# EAGLE design MobilityEliminationController (EAGLE 6.6.0)

## Sheet 1 of 3: MCU
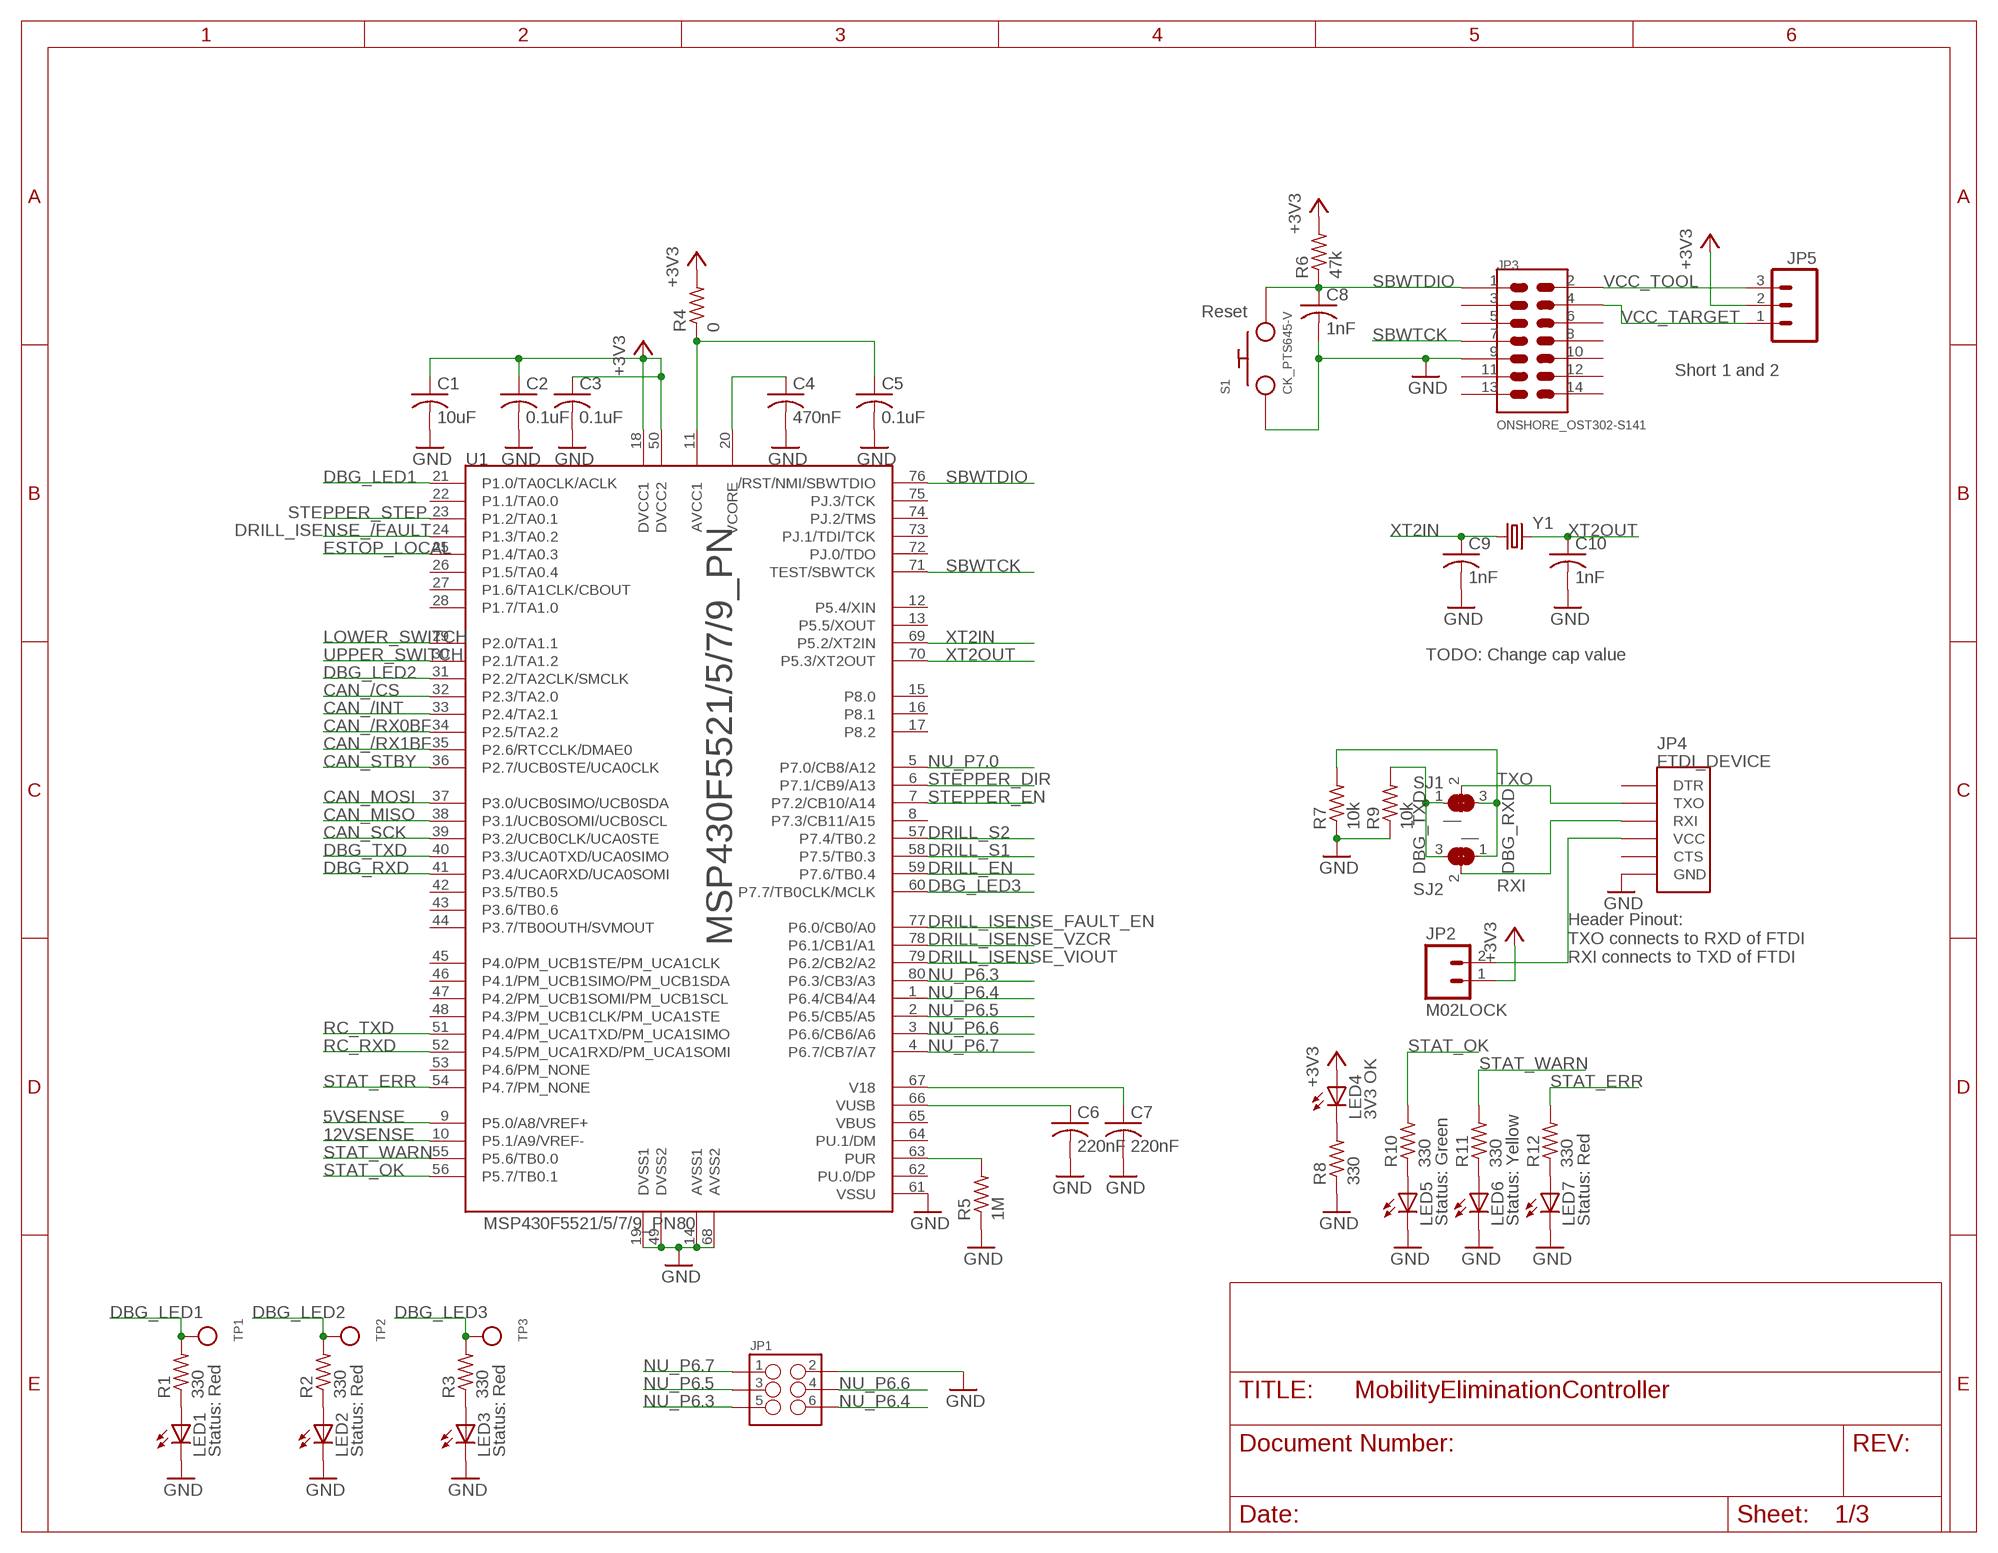
[diagram p0: schematic, sheet 1]

### Parts
C1  10uF  C-USC0805  [C0805]
C2  0.1uF  C-USC0603  [C0603]
C3  0.1uF  C-USC0603  [C0603]
C4  470nF  C-USC0603  [C0603]
C5  0.1uF  C-USC0603  [C0603]
C6  220nF  C-USC0603  [C0603]
C7  220nF  C-USC0603  [C0603]
C8  1nF  C-USC0603  [C0603]
C9  1nF  C-USC0603  [C0603]
C10  1nF  C-USC0603  [C0603]
JP1  M03X22X3_SILK_SM  [2X3]
JP2  M02LOCK  [1X02_LOCK]
JP3  ONSHORE_OST302-S141  [ONSHORE_OST302-S141]
JP4  FTDI_DEVICE  [FTDI_DEVICE_SIDE]
JP5  M03LOCK  [1X03_LOCK]
LED1  Status: Red  LED0603  [LED-0603]
LED2  Status: Red  LED0603  [LED-0603]
LED3  Status: Red  LED0603  [LED-0603]
LED4  3V3 OK  LED0603  [LED-0603]
LED5  Status: Green  LED0603  [LED-0603]
LED6  Status: Yellow  LED0603  [LED-0603]
LED7  Status: Red  LED0603  [LED-0603]
R1  330  R-US_R0603  [R0603]
R2  330  R-US_R0603  [R0603]
R3  330  R-US_R0603  [R0603]
R4  0  R-US_R0603  [R0603]
R5  1M  R-US_R0603  [R0603]
R6  47k  R-US_R0603  [R0603]
R7  10k  R-US_R0603  [R0603]
R8  330  R-US_R0603  [R0603]
R9  10k  R-US_R0603  [R0603]
R10  330  R-US_R0603  [R0603]
R11  330  R-US_R0603  [R0603]
R12  330  R-US_R0603  [R0603]
S1  CK_PTS645-V  [CK_PTS645-V]
SJ1  SOLDERJUMPER_2WAY0603  [SOLDERJUMPER_2WAY_OPEN_0603]
SJ2  SOLDERJUMPER_2WAY0603  [SOLDERJUMPER_2WAY_OPEN_0603]
TP1  TESTPOINT0.1"  [1X01_ROUND]
TP2  TESTPOINT0.1"  [1X01_ROUND]
TP3  TESTPOINT0.1"  [1X01_ROUND]
U1  MSP430F5521/5/7/9_PN80  [PN80]
Y1  CRYSTALHC49UV  [HC49U-V]

### Nets
5VSENSE: U1.9(P5.0/A8/VREF+) ; also sheet 2
12VSENSE: U1.10(P5.1/A9/VREF-) ; also sheet 2
+3V3: C1.1 C2.1 C3.1 JP2.1 JP5.2 LED4.A R4.2 R6.2 U1.18(DVCC1) U1.50(DVCC2) ; also sheet 2,3
AVCC: C5.1 R4.1 U1.11(AVCC1)
CAN_/CS: U1.32(P2.3/TA2.0) ; also sheet 2
CAN_/INT: U1.33(P2.4/TA2.1) ; also sheet 2
CAN_/RX0BF: U1.34(P2.5/TA2.2) ; also sheet 2
CAN_/RX1BF: U1.35(P2.6/RTCCLK/DMAE0) ; also sheet 2
CAN_MISO: U1.38(P3.1/UCB0SOMI/UCB0SCL) ; also sheet 2
CAN_MOSI: U1.37(P3.0/UCB0SIMO/UCB0SDA) ; also sheet 2
CAN_SCK: U1.39(P3.2/UCB0CLK/UCA0STE) ; also sheet 2
CAN_STBY: U1.36(P2.7/UCB0STE/UCA0CLK) ; also sheet 2
DBG_LED1: R1.2 TP1.1 U1.21(P1.0/TA0CLK/ACLK)
DBG_LED2: R2.2 TP2.1 U1.31(P2.2/TA2CLK/SMCLK)
DBG_LED3: R3.2 TP3.1 U1.60(P7.7/TB0CLK/MCLK)
DBG_RXD: R7.2 SJ1.3 SJ2.1 U1.41(P3.4/UCA0RXD/UCA0SOMI)
DBG_TXD: R9.2 SJ1.1 SJ2.3 U1.40(P3.3/UCA0TXD/UCA0SIMO)
DRILL_EN: U1.59(P7.6/TB0.4) ; also sheet 3
DRILL_ISENSE_/FAULT: U1.24(P1.3/TA0.2) ; also sheet 3
DRILL_ISENSE_FAULT_EN: U1.77(P6.0/CB0/A0) ; also sheet 3
DRILL_ISENSE_VIOUT: U1.79(P6.2/CB2/A2) ; also sheet 3
DRILL_ISENSE_VZCR: U1.78(P6.1/CB1/A1) ; also sheet 3
DRILL_S1: U1.58(P7.5/TB0.3) ; also sheet 3
DRILL_S2: U1.57(P7.4/TB0.2) ; also sheet 3
ESTOP_LOCAL: U1.25(P1.4/TA0.3) ; also sheet 2
GND: C1.2 C2.2 C3.2 C4.2 C5.2 C6.2 C7.2 C8.2 C9.2 C10.2 JP1.2 JP3.9 JP4.P$6(GND) LED1.C LED2.C LED3.C LED5.C LED6.C LED7.C R5.1 R7.1 R8.1 R9.1 S1.1 U1.14(AVSS1) U1.19(DVSS1) U1.49(DVSS2) U1.61(VSSU) U1.68(AVSS2) ; also sheet 2,3
LOWER_SWITCH: U1.29(P2.0/TA1.1) ; also sheet 2
N$1: JP2.2 JP4.P$4(VCC)
N$2: LED4.C R8.2
N$3: LED5.A R10.1
N$4: LED6.A R11.1
N$5: LED7.A R12.1
N$6: LED1.A R1.1
N$7: R5.2 U1.63(PUR)
N$8: LED2.A R2.1
N$36: LED3.A R3.1
NU_P6.3: JP1.5 U1.80(P6.3/CB3/A3)
NU_P6.4: JP1.6 U1.1(P6.4/CB4/A4)
NU_P6.5: JP1.3 U1.2(P6.5/CB5/A5)
NU_P6.6: JP1.4 U1.3(P6.6/CB6/A6)
NU_P6.7: JP1.1 U1.4(P6.7/CB7/A7)
NU_P7.0: U1.5(P7.0/CB8/A12)
RC_RXD: U1.52(P4.5/PM_UCA1RXD/PM_UCA1SOMI) ; also sheet 2
RC_TXD: U1.51(P4.4/PM_UCA1TXD/PM_UCA1SIMO) ; also sheet 2
RXI: JP4.P$3(RXI) SJ2.2
SBWTCK: JP3.7 U1.71(TEST/SBWTCK)
SBWTDIO: C8.1 JP3.1 R6.1 S1.2 U1.76(/RST/NMI/SBWTDIO)
STAT_ERR: R12.2 U1.54(P4.7/PM_NONE)
STAT_OK: R10.2 U1.56(P5.7/TB0.1)
STAT_WARN: R11.2 U1.55(P5.6/TB0.0)
STEPPER_DIR: U1.6(P7.1/CB9/A13) ; also sheet 2
STEPPER_EN: U1.7(P7.2/CB10/A14) ; also sheet 2
STEPPER_STEP: U1.23(P1.2/TA0.1) ; also sheet 2
TXO: JP4.P$2(TXO) SJ1.2
UPPER_SWITCH: U1.30(P2.1/TA1.2) ; also sheet 2
V18: C7.1 U1.67(V18)
VCC_TARGET: JP3.4 JP5.1
VCC_TOOL: JP3.2 JP5.3
VCORE: C4.1 U1.20(VCORE)
VUSB: C6.1 U1.66(VUSB)
XT2IN: C9.1 U1.69(P5.2/XT2IN) Y1.1
XT2OUT: C10.1 U1.70(P5.3/XT2OUT) Y1.2
Unconnected: JP3.3 JP3.5 JP3.6 JP3.8 JP3.10 JP3.11 JP3.12 JP3.13 JP3.14 JP4.P$1(DTR) JP4.P$5(CTS) U1.8(P7.3/CB11/A15) U1.12(P5.4/XIN) U1.13(P5.5/XOUT) U1.15(P8.0) U1.16(P8.1) U1.17(P8.2) U1.22(P1.1/TA0.0) U1.26(P1.5/TA0.4) U1.27(P1.6/TA1CLK/CBOUT) U1.28(P1.7/TA1.0) U1.42(P3.5/TB0.5) U1.43(P3.6/TB0.6) U1.44(P3.7/TB0OUTH/SVMOUT) U1.45(P4.0/PM_UCB1STE/PM_UCA1CLK) U1.46(P4.1/PM_UCB1SIMO/PM_UCB1SDA) U1.47(P4.2/PM_UCB1SOMI/PM_UCB1SCL) U1.48(P4.3/PM_UCB1CLK/PM_UCA1STE) U1.53(P4.6/PM_NONE) U1.62(PU.0/DP) U1.64(PU.1/DM) U1.65(VBUS) U1.72(PJ.0/TDO) U1.73(PJ.1/TDI/TCK) U1.74(PJ.2/TMS) U1.75(PJ.3/TCK)

### Notes on the sheet
- Reset
- Short 1 and 2
- TODO: Change cap value
- Header Pinout:
  TXO connects to RXD of FTDI
  RXI connects to TXD of FTDI

## Sheet 2 of 3: External
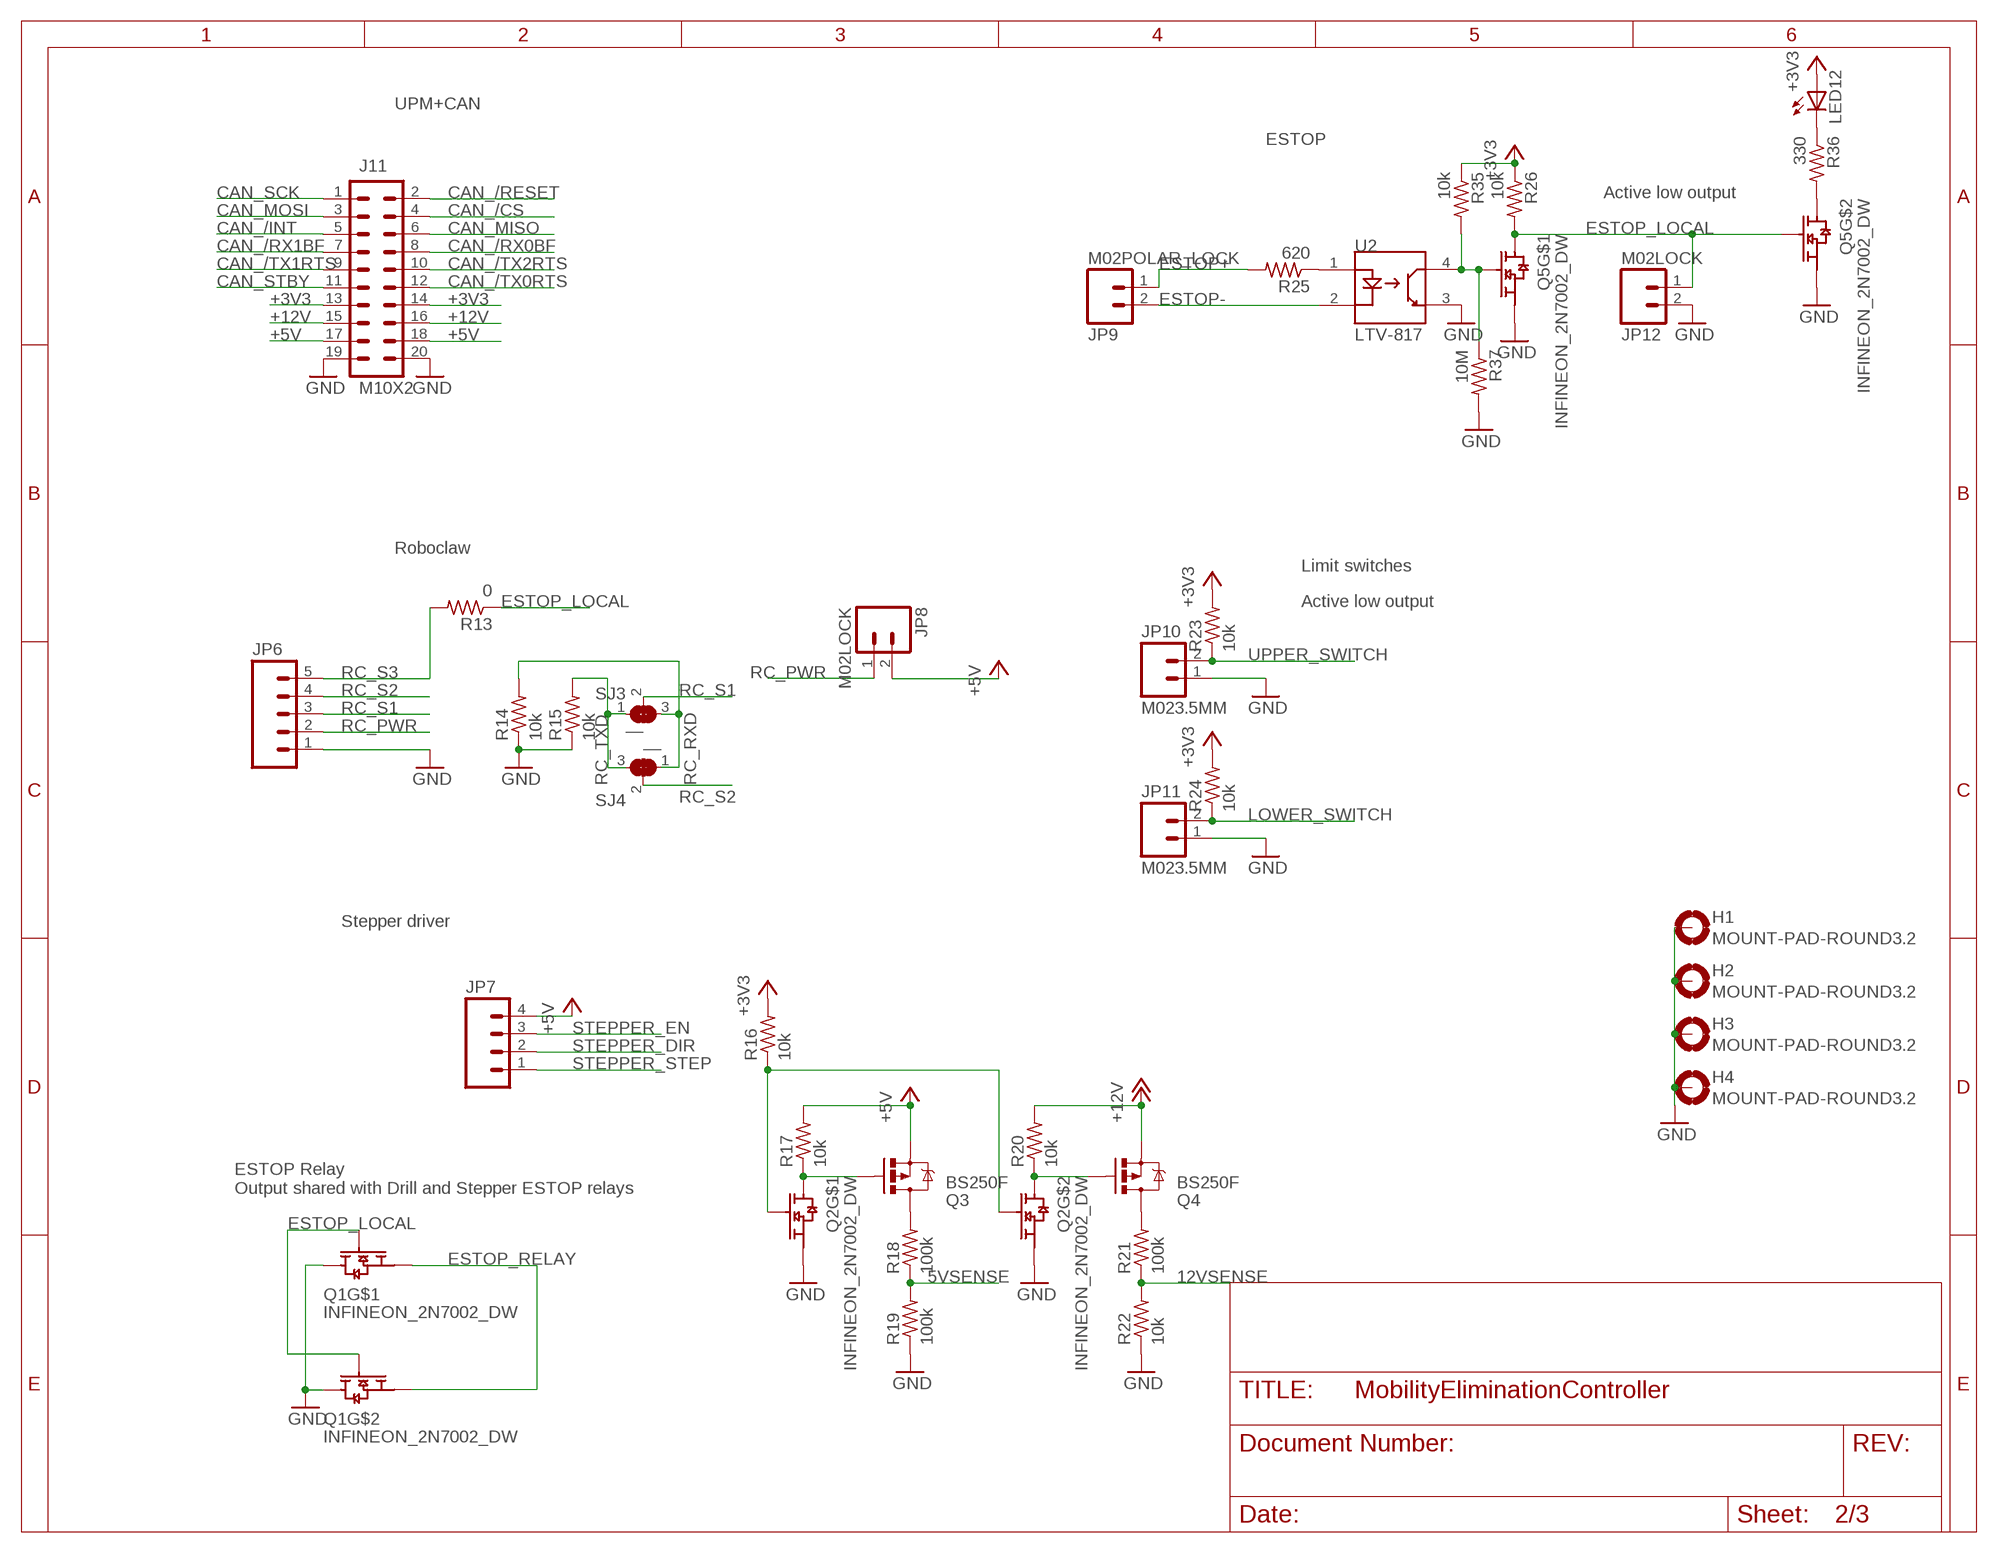
[diagram p1: schematic, sheet 2]

### Parts
H1  MOUNT-PAD-ROUND3.2  [3,2-PAD]
H2  MOUNT-PAD-ROUND3.2  [3,2-PAD]
H3  MOUNT-PAD-ROUND3.2  [3,2-PAD]
H4  MOUNT-PAD-ROUND3.2  [3,2-PAD]
J11  M10X2  [2X10]
JP6  M05LOCK  [1X05_LOCK]
JP7  M04SCREW  [SCREWTERMINAL-3.5MM-4]
JP8  M02LOCK  [1X02_LOCK]
JP9  M02POLAR_LOCK  [MOLEX-1X2_LOCK]
JP10  M023.5MM  [SCREWTERMINAL-3.5MM-2]
JP11  M023.5MM  [SCREWTERMINAL-3.5MM-2]
JP12  M02LOCK  [1X02_LOCK]
LED12  LED0603  [LED-0603]
Q1  INFINEON_2N7002_DW  [INFINEON_SOT363]
Q2  INFINEON_2N7002_DW  [INFINEON_SOT363]
Q3  BS250F  MOSFET-PCHANNELSMD  [SOT23-3]
Q4  BS250F  MOSFET-PCHANNELSMD  [SOT23-3]
Q5  INFINEON_2N7002_DW  [INFINEON_SOT363]
R13  0  R-US_R0603  [R0603]
R14  10k  R-US_R0603  [R0603]
R15  10k  R-US_R0603  [R0603]
R16  10k  R-US_R0603  [R0603]
R17  10k  R-US_R0603  [R0603]
R18  100k  R-US_R0603  [R0603]
R19  100k  R-US_R0603  [R0603]
R20  10k  R-US_R0603  [R0603]
R21  100k  R-US_R0603  [R0603]
R22  10k  R-US_R0603  [R0603]
R23  10k  R-US_R0603  [R0603]
R24  10k  R-US_R0603  [R0603]
R25  620  R-US_R0603  [R0603]
R26  10k  R-US_R0603  [R0603]
R35  10k  R-US_R0603  [R0603]
R36  330  R-US_R0603  [R0603]
R37  10M  R-US_R0603  [R0603]
SJ3  SOLDERJUMPER_2WAY0603  [SOLDERJUMPER_2WAY_OPEN_0603]
SJ4  SOLDERJUMPER_2WAY0603  [SOLDERJUMPER_2WAY_OPEN_0603]
U2  LTV-817  [LITEON_DIL04_.3]

### Nets
5VSENSE: R18.1 R19.2 ; also sheet 1
12VSENSE: R21.1 R22.2 ; also sheet 1
+3V3: J11.13 J11.14 LED12.A R16.2 R23.2 R24.2 R26.1 R35.1 ; also sheet 1,3
+5V: J11.17 J11.18 JP7.4 JP8.2 Q3.2(S) R17.2
+12V: J11.15 J11.16 Q4.2(S) R20.2 ; also sheet 3
CAN_/CS: J11.4 ; also sheet 1
CAN_/INT: J11.5 ; also sheet 1
CAN_/RESET: J11.2
CAN_/RX0BF: J11.8 ; also sheet 1
CAN_/RX1BF: J11.7 ; also sheet 1
CAN_/TX0RTS: J11.12
CAN_/TX1RTS: J11.9
CAN_/TX2RTS: J11.10
CAN_MISO: J11.6 ; also sheet 1
CAN_MOSI: J11.3 ; also sheet 1
CAN_SCK: J11.1 ; also sheet 1
CAN_STBY: J11.11 ; also sheet 1
ESTOP+: JP9.1 R25.2
ESTOP-: JP9.2 U2.2
ESTOP_LOCAL: JP12.1 Q1.2(GATE) Q1.5(GATE) Q5.5(GATE) Q5.6(DRAIN) R13.1 R26.2 ; also sheet 1
ESTOP_LOCAL_INV: Q5.2(GATE) R35.2 R37.1 U2.4
ESTOP_RELAY: Q1.1(SOURCE) Q1.4(SOURCE) ; also sheet 3
GND: H1.B3,2(MOUNT) H2.B3,2(MOUNT) H3.B3,2(MOUNT) H4.B3,2(MOUNT) J11.19 J11.20 JP6.1 JP10.1 JP11.1 JP12.2 Q1.3(DRAIN) Q1.6(DRAIN) Q2.1(SOURCE) Q2.4(SOURCE) Q5.1(SOURCE) Q5.4(SOURCE) R14.1 R15.1 R19.1 R22.1 R37.2 U2.3 ; also sheet 1,3
LOWER_SWITCH: JP11.2 R24.1 ; also sheet 1
N$9: Q3.3(D) R18.2
N$10: Q2.6(DRAIN) Q3.1(G) R17.1
N$11: Q4.3(D) R21.2
N$12: Q2.2(GATE) Q2.5(GATE) R16.1
N$13: R25.1 U2.1
N$15: Q5.3(DRAIN) R36.2
N$16: LED12.C R36.1
RC_PWR: JP6.2 JP8.1
RC_RXD: R14.2 SJ3.3 SJ4.1 ; also sheet 1
RC_S1: JP6.3 SJ3.2
RC_S2: JP6.4 SJ4.2
RC_S3: JP6.5 R13.2
RC_TXD: R15.2 SJ3.1 SJ4.3 ; also sheet 1
STEPPER_DIR: JP7.2 ; also sheet 1
STEPPER_EN: JP7.3 ; also sheet 1
STEPPER_STEP: JP7.1 ; also sheet 1
UPPER_SWITCH: JP10.2 R23.1 ; also sheet 1
VTAP_EN: Q2.3(DRAIN) Q4.1(G) R20.1

### Notes on the sheet
- UPM+CAN
- ESTOP
- Active low output
- Roboclaw
- Limit switches
- Active low output
- Stepper driver
- ESTOP Relay
  Output shared with Drill and Stepper ESTOP relays

## Sheet 3 of 3
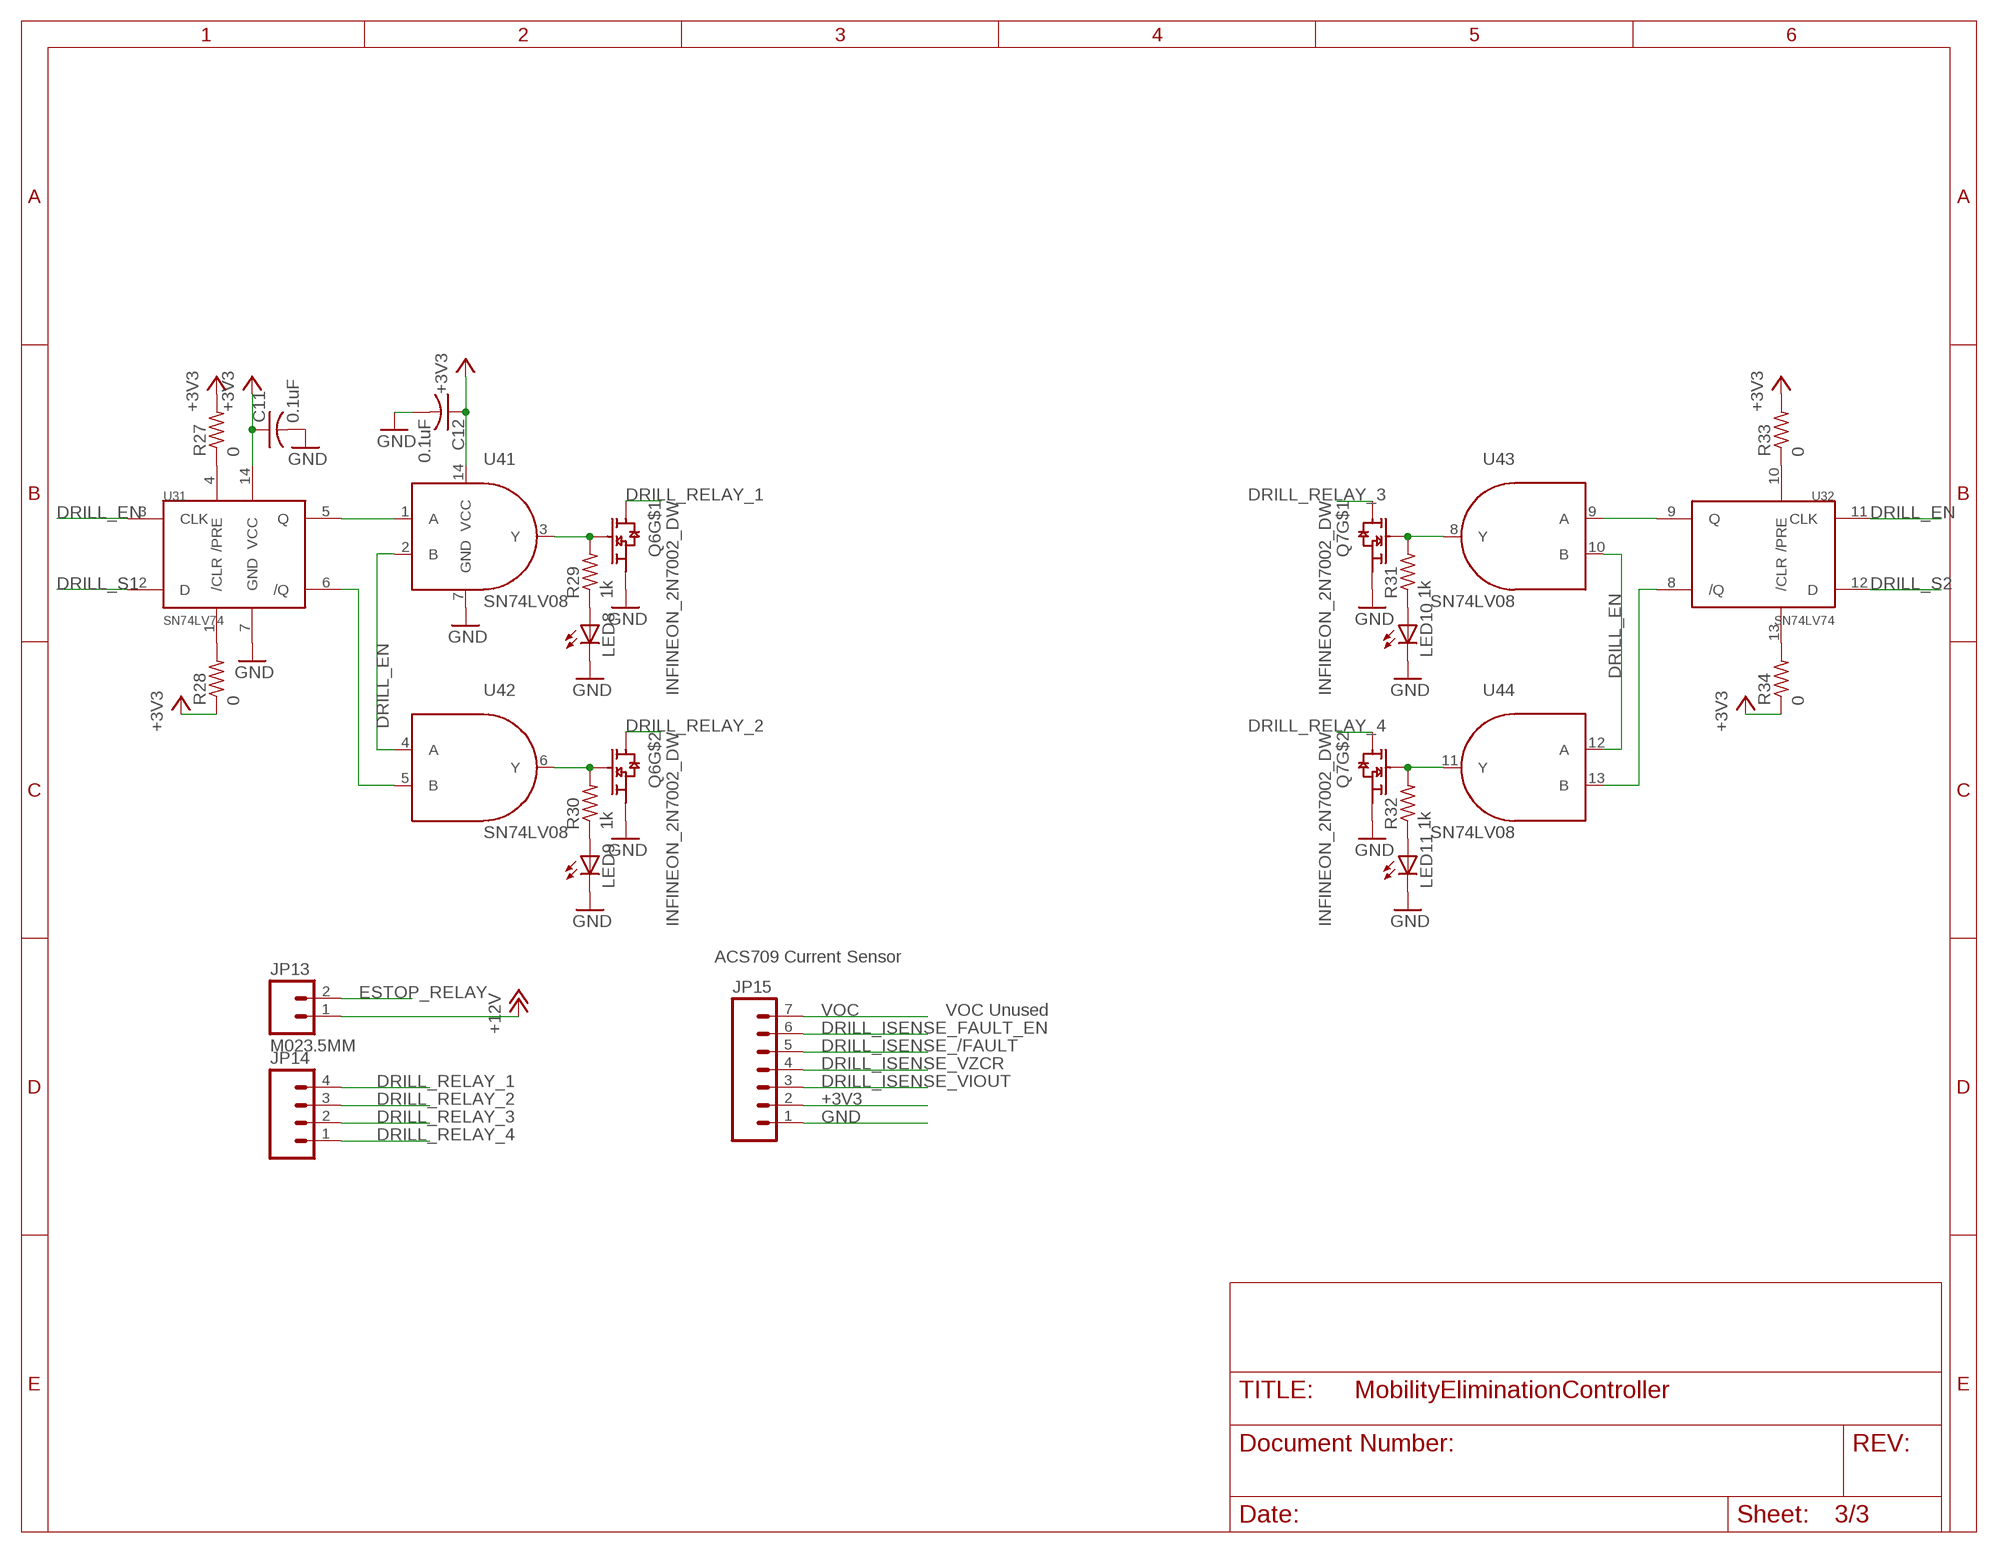
[diagram p2: schematic, sheet 3]

### Parts
C11  0.1uF  C-USC0603  [C0603]
C12  0.1uF  C-USC0603  [C0603]
JP13  M023.5MM  [SCREWTERMINAL-3.5MM-2]
JP14  M04SCREW  [SCREWTERMINAL-3.5MM-4]
JP15  M07  [1X07]
LED8  LED0603  [LED-0603]
LED9  LED0603  [LED-0603]
LED10  LED0603  [LED-0603]
LED11  LED0603  [LED-0603]
Q6  INFINEON_2N7002_DW  [INFINEON_SOT363]
Q7  INFINEON_2N7002_DW  [INFINEON_SOT363]
R27  0  R-US_R0603  [R0603]
R28  0  R-US_R0603  [R0603]
R29  1k  R-US_R0603  [R0603]
R30  1k  R-US_R0603  [R0603]
R31  1k  R-US_R0603  [R0603]
R32  1k  R-US_R0603  [R0603]
R33  0  R-US_R0603  [R0603]
R34  0  R-US_R0603  [R0603]
U3  SN74LV74  [TI_D_R-PDSO-G14_SOIC14]
U4  SN74LV08  [TI_D_R-PDSO-G14_SOIC14]

### Nets
+3V3: C11.1 C12.1 JP15.2 R27.2 R28.1 R33.2 R34.1 U3.14(1:VCC) U4.14(1:VCC) ; also sheet 1,2
+12V: JP13.1 ; also sheet 2
DRILL_EN: U3.3(1:CLK) U3.11(2:CLK) U4.2(1:B) U4.4(2:A) U4.10(3:B) U4.12(4:A) ; also sheet 1
DRILL_ISENSE_/FAULT: JP15.5 ; also sheet 1
DRILL_ISENSE_FAULT_EN: JP15.6 ; also sheet 1
DRILL_ISENSE_VIOUT: JP15.3 ; also sheet 1
DRILL_ISENSE_VZCR: JP15.4 ; also sheet 1
DRILL_RELAY_1: JP14.4 Q6.6(DRAIN)
DRILL_RELAY_2: JP14.3 Q6.3(DRAIN)
DRILL_RELAY_3: JP14.2 Q7.6(DRAIN)
DRILL_RELAY_4: JP14.1 Q7.3(DRAIN)
DRILL_S1: U3.2(1:D) ; also sheet 1
DRILL_S2: U3.12(2:D) ; also sheet 1
ESTOP_RELAY: JP13.2 ; also sheet 2
GND: C11.2 C12.2 JP15.1 LED8.C LED9.C LED10.C LED11.C Q6.1(SOURCE) Q6.4(SOURCE) Q7.1(SOURCE) Q7.4(SOURCE) U3.7(1:GND) U4.7(1:GND) ; also sheet 1,2
N$14: LED9.A R30.1
N$20: U3.5(1:Q) U4.1(1:A)
N$22: U3.6(1:/Q) U4.5(2:B)
N$23: U3.9(2:Q) U4.9(3:A)
N$25: U3.8(2:/Q) U4.13(4:B)
N$26: R27.1 U3.4(1:/PRE)
N$27: R28.2 U3.1(1:/CLR)
N$28: R33.1 U3.10(2:/PRE)
N$29: R34.2 U3.13(2:/CLR)
N$33: LED11.A R32.1
RELAY1_CNTRL: Q6.2(GATE) R29.2 U4.3(1:Y)
RELAY1_LED_A: LED8.A R29.1
RELAY2_CNTRL: Q6.5(GATE) R30.2 U4.6(2:Y)
RELAY3_CNTRL: Q7.2(GATE) R31.2 U4.8(3:Y)
RELAY3_LED_A: LED10.A R31.1
RELAY4_CNTRL: Q7.5(GATE) R32.2 U4.11(4:Y)
VOC: JP15.7

### Notes on the sheet
- ACS709 Current Sensor
- VOC Unused

## Library data of the parts
C1-C12 = rcl:C-US: CAPACITOR, American symbol
H1-H4 = holes:MOUNT-PAD-ROUND: MOUNTING PAD, round
J11 = SparkFun-Connectors:M10X2: This was SPECIALLY designed to be used with our Graphic LCD Backpack. Be sure you want to use this! It is not only staggered on each line of header holes, but IT IS ALSO offset of the center point of the top and bottom lines by 5 mil. This causes the headers to lock into place on the "standard" footprint on the LCD screen. The extra squares on the tdocu layer are there simply to reference other pins (if you were to actually populate a longer header than ten long - this is what we do with the backpacks).
JP1 = SparkFun-Connectors:M03X2: 2x3 .1" header. Shrouded, with keying- CONN-10681 SMT- CONN-11415 Pogo pins- HW-11044
JP2 JP8-JP13 = SparkFun-Connectors:M02: Standard 2-pin 0.1" header. Use with - straight break away headers ( PRT-00116) - right angle break away headers (PRT-00553) - swiss pins (PRT-00743) - machine pins (PRT-00117) - female headers (PRT-00115) Molex polarized connector foot print use with: PRT-08233 with associated crimp pins and housings. 2.54_SCREWTERM for use with PRT-10571. 3.5mm Screw Terminal footprints for PRT-08084 5mm Screw Terminal footprints for use with PRT-08433
JP3 = npol-connectors:ONSHORE_OST302-S141
JP4 = SparkFun-Connectors:FTDI_DEVICE: Connector which mates to FTDI basic or FTDI cable.
JP5 = SparkFun-Connectors:M03: Header 3 Standard 3-pin 0.1" header. Use with straight break away headers (SKU : PRT-00116), right angle break away headers (PRT-00553), swiss pins (PRT-00743), machine pins (PRT-00117), and female headers (PRT-00115). Molex polarized connector foot print use with SKU : PRT-08232 with associated crimp pins and housings.
JP6 = SparkFun-Connectors:M05: Header 5 Standard 5-pin 0.1" header. Use with straight break away headers (SKU : PRT-00116), right angle break away headers (PRT-00553), swiss pins (PRT-00743), machine pins (PRT-00117), and female headers (PRT-00115). Molex polarized connector foot print use with SKU : PRT-08230 with associated crimp pins and housings.
JP7 JP14 = SparkFun-Connectors:M04: Header 4 Standard 4-pin 0.1" header. Use with straight break away headers (SKU : PRT-00116), right angle break away headers (PRT-00553), swiss pins (PRT-00743), machine pins (PRT-00117), and female headers (PRT-00115). Molex polarized connector foot print use with SKU : PRT-08231 with associated crimp pins and housings. 1MM SMD Version SKU: PRT-10208
JP15 = SparkFun-Connectors:M07: Header 7 Standard 7-pin 0.1" header. Use with straight break away headers (SKU : PRT-00116), right angle break away headers (PRT-00553), swiss pins (PRT-00743), machine pins (PRT-00117), and female headers (PRT-00115). NOTES ON THE VARIANTS LOCK and LOCK_LONGPADS... This footprint was designed to help hold the alignment of a through-hole component (i.e. 7-pin header) while soldering it into place. You may notice that each hole has been shifted either up or down by 0.005 of an inch from it's more standard position (which is usually a perfectly straight line). This slight alteration caused the pins (the squares in the middle) to touch the edges of the holes. Because they are alternating, it causes a "brace" to hold the header in place. 0.005 has proven to be the perfect amount of "off-center" position when using our standard breakaway headers. Although looks a little odd when you look at the bare footprint, once you have a header in there, the alteration is very hard to notice. Also, if you push a header all the way into place, it is covered up entirely on the bottom side. This idea of altering the position of holes to aid alignment will be further integrated into the Sparkfun Library for other footprints. It can help hold any component with 3 or more connection pins.
LED1-LED12 = SparkFun-LED:LED: LEDs Standard schematic elements and footprints for 5mm, 3mm, 1206, and 0603 sized LEDs. 5mm - Spark Fun Electronics SKU : COM-00529 (and others)
Q1 Q2 Q5-Q7 = npol-discrete:INFINEON_2N7002_DW
Q3 Q4 = SparkFun-DiscreteSemi:MOSFET-PCHANNEL: Generic PMOSFET
R1-R37 = rcl:R-US_: RESISTOR, American symbol
S1 = npol-electromechanical:CK_PTS645-V
SJ1-SJ4 = microbuilder:SOLDERJUMPER_2WAY: 2-Way Solder Jumper
TP1-TP3 = microbuilder:TESTPOINT: Test Point Various test points for characterisation and PCB testing TESTPOINT_SMT - Compact Surface Mount Test Point [Digikey: 5016KTR-ND]; BOM: EXCLUDE
U1 = npol-msp430:MSP430F5521/5/7/9_PN80
U2 = npol-digital:LTV-817
U3 = npol-digital:SN74LV74
U4 = npol-digital:SN74LV08
Y1 = SparkFun-FreqCtrl:CRYSTAL: Various standard crystals. Proven footprints. Spark Fun Electronics SKU : COM-00534

## Board
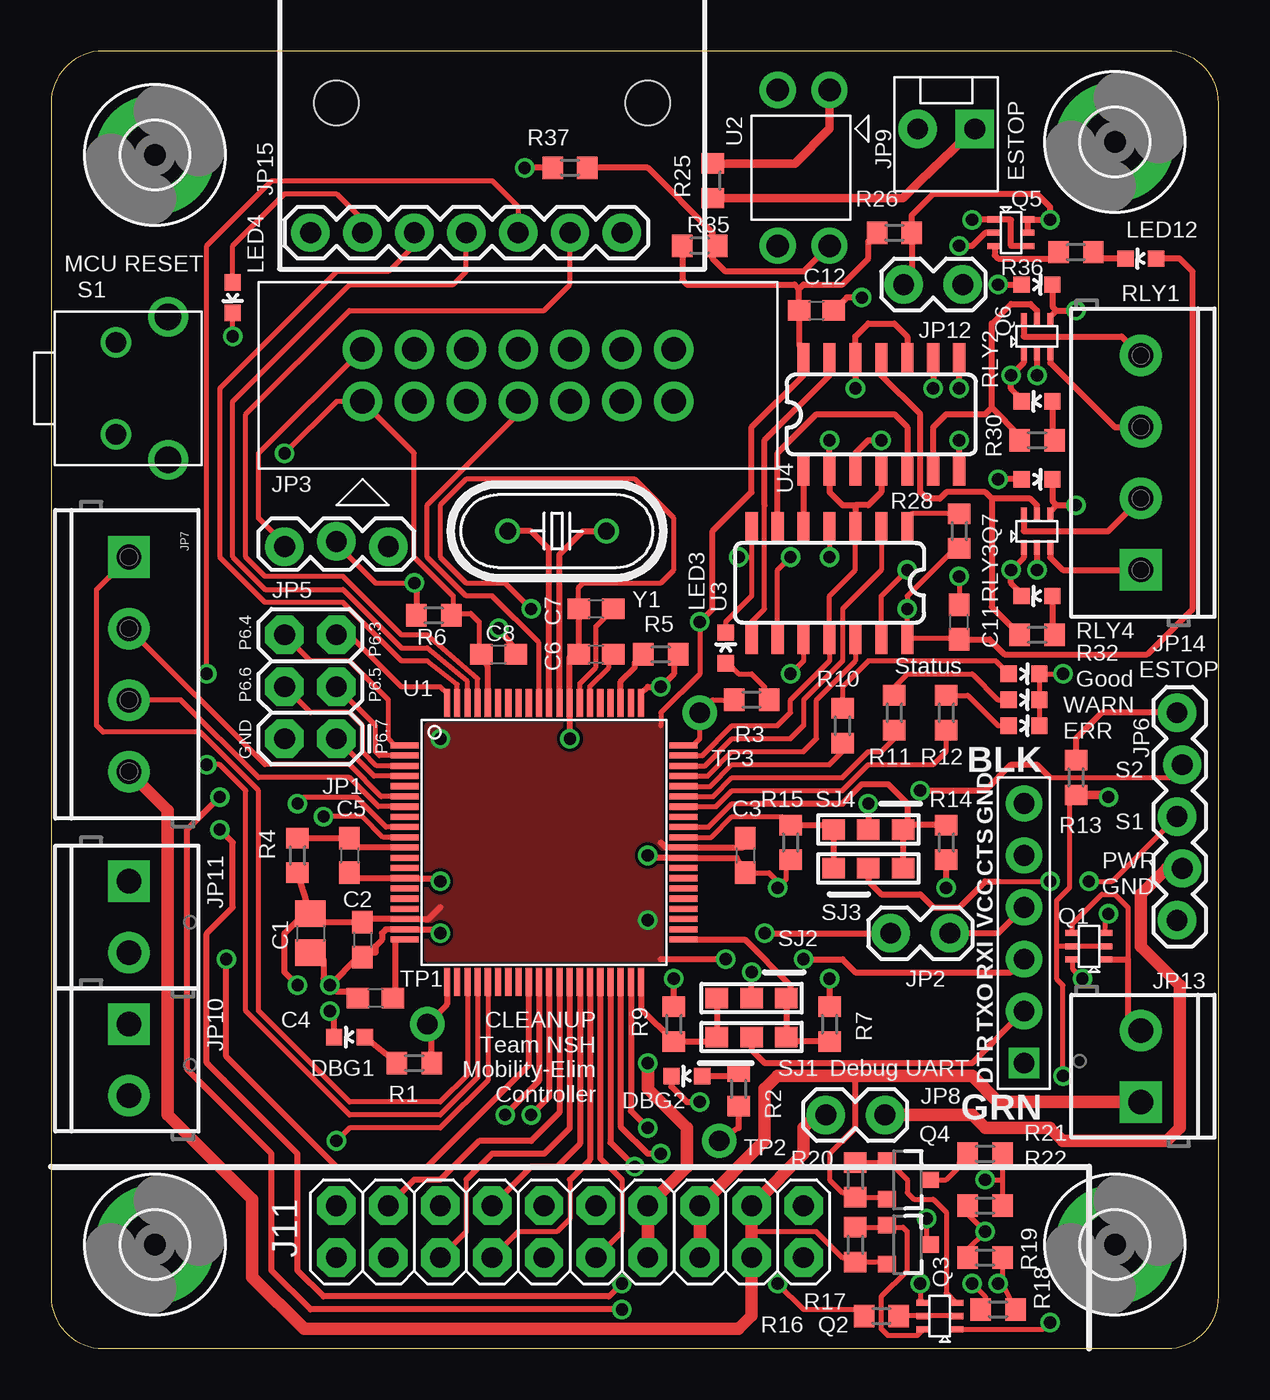
[diagram p3: board, top side]
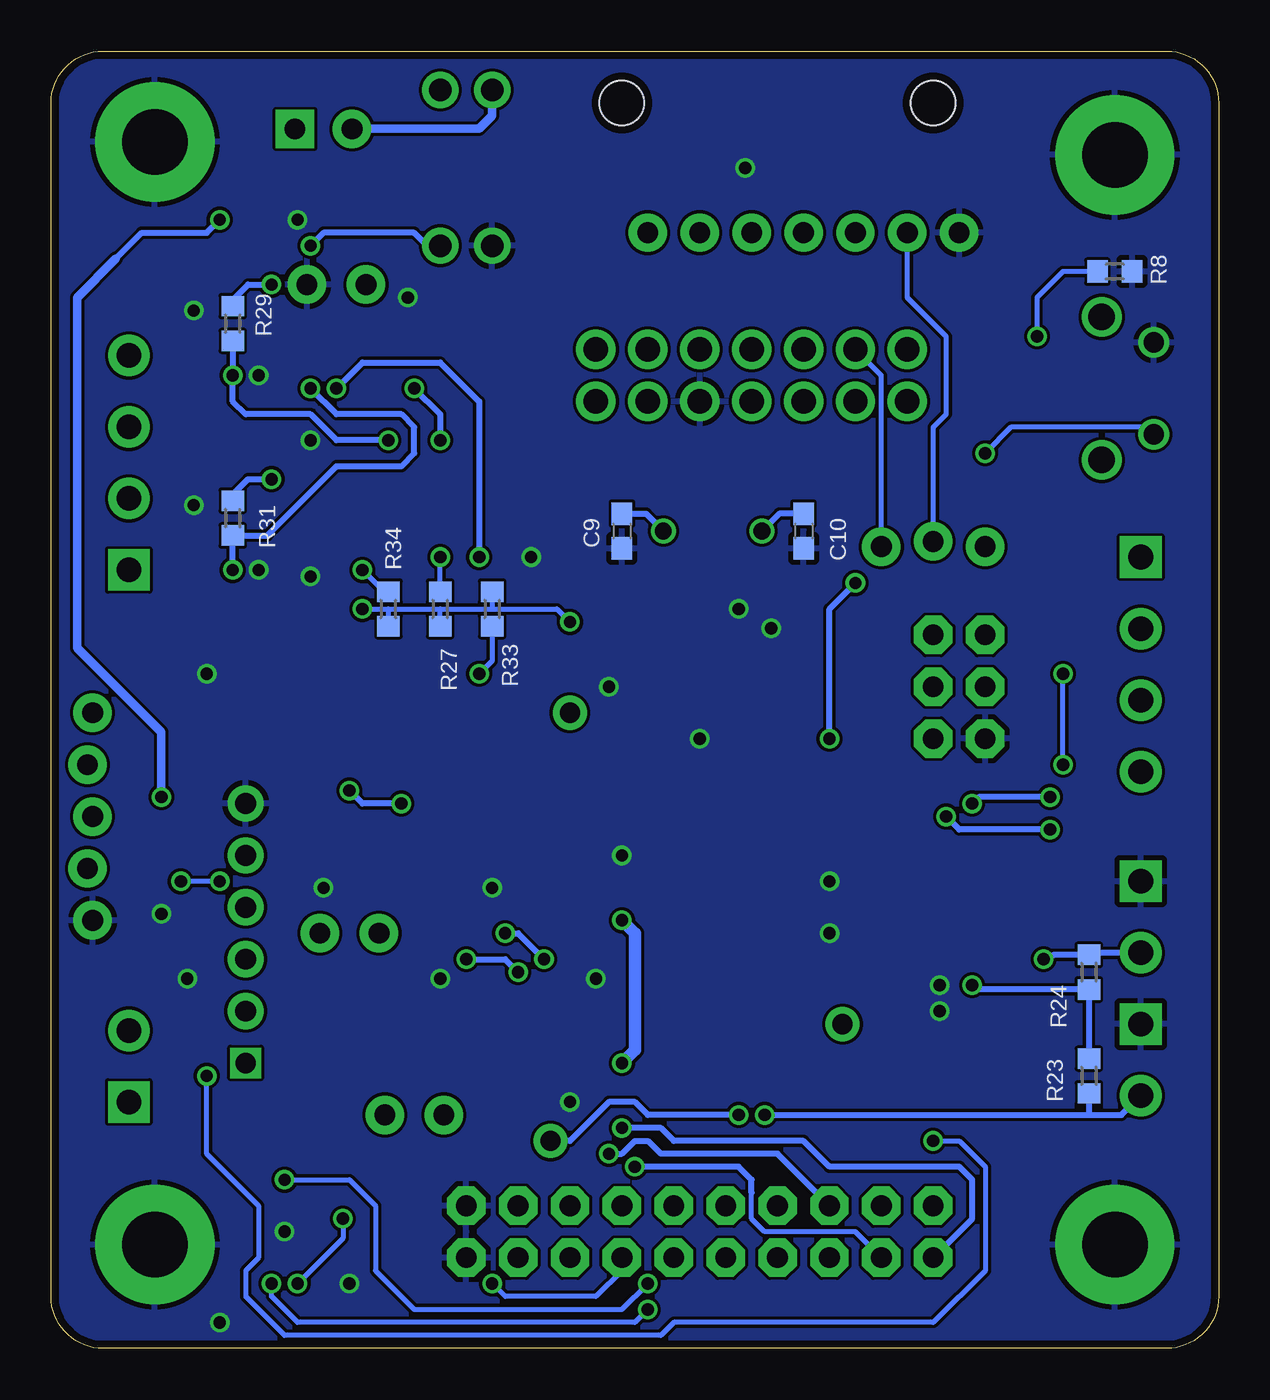
[diagram p4: board, bottom side, seen from below]

Size 57.15 x 63.5 mm. Coordinates in mm from the lower left corner, seen from the top.
Outline: 0,60.96 0,2.54 arc90 2.54,0 54.61,0 arc90 57.15,2.54 57.15,60.96 arc90 54.61,63.5 2.54,63.5 arc90 0,60.96
Copper layers (1*16): Top 0.0356mm / dielectric 1.5011mm / Bottom 0.0356mm
Design rules "OshPark": minimum track width 6mil, minimum drill 13mil, track to track 6mil, track to pad 6mil, pad to pad 6mil, via to via 6mil, smd to smd 6mil, copper to edge 15mil, drill to drill 6mil, minimum pad ring 7mil, minimum via ring 7mil, stop-mask expansion 4mil, vias tented up to drill 0mil, thermal gap 10mil
Holes 2.18 mm at 13.97,60.96 29.21,60.96

### Footprints (pad centres in the part's own frame; a part is rotated, then mirrored left to right if it is on the bottom)
C0805 = smd 1.3 x 1.5: 1 -0.95,0; 2 0.95,0
C0603 = smd 1.1 x 1: 1 -0.85,0; 2 0.85,0
3,2-PAD = drill 3.2 pad 5.842: B3,2 0,0
2X10 = drill 1.016 pad 1.88 octagon: 1 -11.43,-1.27; 2 -11.43,1.27; 3 -8.89,-1.27; 4 -8.89,1.27; 5 -6.35,-1.27; 6 -6.35,1.27; 7 -3.81,-1.27; 8 -3.81,1.27; 9 -1.27,-1.27; 10 -1.27,1.27; 11 1.27,-1.27; 12 1.27,1.27; 13 3.81,-1.27; 14 3.81,1.27; 15 6.35,-1.27; 16 6.35,1.27; 17 8.89,-1.27; 18 8.89,1.27; 19 11.43,-1.27; 20 11.43,1.27
2X3 = drill 1.016 pad 1.88 octagon: 1 0,0; 2 0,2.54; 3 2.54,0; 4 2.54,2.54; 5 5.08,0; 6 5.08,2.54
1X02_LOCK = drill 1.016 pad 1.88: 1 -0.178,0; 2 2.718,0
ONSHORE_OST302-S141 = drill 1.194 pad 1.93: 1 -7.62,-1.27; 2 -7.62,1.27; 3 -5.08,-1.27; 4 -5.08,1.27; 5 -2.54,-1.27; 6 -2.54,1.27; 7 0,-1.27; 8 0,1.27; 9 2.54,-1.27; 10 2.54,1.27; 11 5.08,-1.27; 12 5.08,1.27; 13 7.62,-1.27; 14 7.62,1.27
FTDI_DEVICE_SIDE = drill 1 square: P$1 -6.35,0 | drill 1.016 pad 1.778: P$2 -3.81,0; P$3 -1.27,0; P$4 1.27,0; P$5 3.81,0; P$6 6.35,0
1X03_LOCK = drill 1.016 pad 1.88: 1 0,0.127; 2 2.54,-0.127; 3 5.08,0.127
1X05_LOCK = drill 1.016 pad 1.88: 1 0,0.127; 2 2.54,-0.127; 3 5.08,0.127; 4 7.62,-0.127; 5 10.16,0.127
SCREWTERMINAL-3.5MM-4 = drill 1.2 pad 2.032 square: 1 0,0 | drill 1.2 pad 2.032: 2 3.5,0; 3 7,0; 4 10.5,0
MOLEX-1X2_LOCK = drill 1.016 pad 1.88 square: 1 -0.127,0 | drill 1.016 pad 1.88: 2 2.667,0
SCREWTERMINAL-3.5MM-2 = drill 1.2 pad 2.032 square: 1 0,0 | drill 1.2 pad 2.032: 2 3.5,0
1X07 = drill 1.016 pad 1.88: 1 0,0; 2 2.54,0; 3 5.08,0; 4 7.62,0; 5 10.16,0; 6 12.7,0; 7 15.24,0
LED-0603 = smd 0.8 x 0.8: A 0,-0.75; C 0,0.75
INFINEON_SOT363 = smd 0.3 x 0.7: 1 -0.65,-0.8; 2 0,-0.8; 3 0.65,-0.8; 4 0.65,0.8; 5 0,0.8; 6 -0.65,0.8
SOT23-3 = smd 0.8 x 0.9: 1 -0.95,-1; 2 0.95,-1; 3 0,1.1
R0603 = smd 1 x 1.1: 1 -0.85,0; 2 0.85,0
CK_PTS645-V = drill 1: 1 -2.25,0; 2 2.25,0 | drill 1.3: P$2 3.5,2.55; S1 -3.5,2.55
SOLDERJUMPER_2WAY_OPEN_0603 = smd 1.1 x 1: 1 -1.7,0; 2 0,0; 3 1.7,0
1X01_ROUND = drill 1 pad 1.676: 1 0,0
PN80 = smd 1.35 x 0.3: 1 -6.825,4.75; 2 -6.825,4.25; 3 -6.825,3.75; 4 -6.825,3.25; 5 -6.825,2.75; 6 -6.825,2.25; 7 -6.825,1.75; 8 -6.825,1.25; 9 -6.825,0.75; 10 -6.825,0.25; 11 -6.825,-0.25; 12 -6.825,-0.75; 13 -6.825,-1.25; 14 -6.825,-1.75; 15 -6.825,-2.25; 16 -6.825,-2.75; 17 -6.825,-3.25; 18 -6.825,-3.75; 19 -6.825,-4.25; 20 -6.825,-4.75; 41 6.825,-4.75; 42 6.825,-4.25; 43 6.825,-3.75; 44 6.825,-3.25; 45 6.825,-2.75; 46 6.825,-2.25; 47 6.825,-1.75; 48 6.825,-1.25; 49 6.825,-0.75; 50 6.825,-0.25; 51 6.825,0.25; 52 6.825,0.75; 53 6.825,1.25; 54 6.825,1.75; 55 6.825,2.25; 56 6.825,2.75; 57 6.825,3.25; 58 6.825,3.75; 59 6.825,4.25; 60 6.825,4.75 | smd 0.3 x 1.35: 21 -4.75,-6.825; 22 -4.25,-6.825; 23 -3.75,-6.825; 24 -3.25,-6.825; 25 -2.75,-6.825; 26 -2.25,-6.825; 27 -1.75,-6.825; 28 -1.25,-6.825; 29 -0.75,-6.825; 30 -0.25,-6.825; 31 0.25,-6.825; 32 0.75,-6.825; 33 1.25,-6.825; 34 1.75,-6.825; 35 2.25,-6.825; 36 2.75,-6.825; 37 3.25,-6.825; 38 3.75,-6.825; 39 4.25,-6.825; 40 4.75,-6.825; 61 4.75,6.825; 62 4.25,6.825; 63 3.75,6.825; 64 3.25,6.825; 65 2.75,6.825; 66 2.25,6.825; 67 1.75,6.825; 68 1.25,6.825; 69 0.75,6.825; 70 0.25,6.825; 71 -0.25,6.825; 72 -0.75,6.825; 73 -1.25,6.825; 74 -1.75,6.825; 75 -2.25,6.825; 76 -2.75,6.825; 77 -3.25,6.825; 78 -3.75,6.825; 79 -4.25,6.825; 80 -4.75,6.825
LITEON_DIL04_.3 = drill 1.1 pad 1.778: 1 -3.81,1.27; 2 -3.81,-1.27; 3 3.81,-1.27; 4 3.81,1.27
TI_D_R-PDSO-G14_SOIC14 = smd 0.6 x 1.55: 1 -4.445,-2.7; 2 -3.175,-2.7; 3 -1.905,-2.7; 4 -0.635,-2.7; 5 0.635,-2.7; 6 1.905,-2.7; 7 3.175,-2.7; 8 3.175,2.7; 9 1.905,2.7; 10 0.635,2.7; 11 -0.635,2.7; 12 -1.905,2.7; 13 -3.175,2.7; 14 -4.445,2.7
HC49U-V = drill 0.813: 1 -2.413,0; 2 2.413,0

### Placement (x,y rotation side)
C1  12.7,20.32 270 top
C2  15.24,20 270 top
C3  33.97,24.13 270 top
C4  15.88,17.14 180 top
C5  14.61,24.13 270 top
C6  26.67,33.97 180 top
C7  26.67,36.2 180 top
C8  21.91,33.97 0 top
C9  29.21,40.01 270 bottom
C10  20.32,40.01 270 bottom
C11  44.45,35.56 90 top
C12  37.47,50.8 0 top
H1  5.08,5.08 0 top
H2  52.07,5.08 0 top
H3  52.07,59.05 0 top
H4  5.08,58.42 0 top
J11  25.4,5.71 0 top
JP1  13.97,29.84 90 top
JP2  41.27,20.32 0 top
JP3  22.86,47.62 0 top
JP4  47.62,20.32 90 top
JP5  16.51,39.37 180 top
JP6  55.24,20.95 90 top
JP7  3.81,38.73 270 top
JP8  40.64,11.43 180 top
JP9  45.09,59.69 180 top
JP10  3.81,15.88 270 top
JP11  3.81,22.86 270 top
JP12  41.91,52.07 0 top
JP13  53.34,12.06 90 top
JP14  53.34,38.1 90 top
JP15  12.7,54.61 0 top
LED1  14.61,15.24 90 top
LED2  31.11,13.34 90 top
LED3  33.02,34.29 0 top
LED4  8.89,51.44 180 top
LED5  47.62,33.02 270 top
LED6  47.62,31.75 270 top
LED7  47.62,30.48 270 top
LED8  48.26,52.07 270 top
LED9  48.26,46.35 90 top
LED10  48.26,42.55 270 top
LED11  48.26,36.83 90 top
LED12  53.34,53.34 90 top
Q1  50.8,19.68 90 top
Q2  43.5,1.59 90 top
Q3  41.91,5.08 270 top
Q4  41.91,8.26 270 top
Q5  46.99,54.61 270 top
Q6  48.26,49.53 0 top
Q7  48.26,40.01 0 top
R1  17.78,13.97 0 top
R2  33.66,12.7 270 top
R3  34.29,31.75 180 top
R4  12.06,24.13 270 top
R5  29.84,33.97 180 top
R6  18.73,35.88 180 top
R7  38.1,15.88 270 top
R8  5.08,52.7 180 bottom
R9  30.48,15.88 270 top
R10  38.73,30.48 270 top
R11  41.27,31.11 270 top
R12  43.81,31.11 270 top
R13  50.16,27.94 90 top
R14  43.81,24.77 90 top
R15  36.2,24.77 90 top
R16  40.64,1.59 180 top
R17  39.37,5.08 270 top
R18  46.35,1.91 180 top
R19  45.72,4.45 0 top
R20  39.37,8.26 270 top
R21  45.72,9.53 180 top
R22  45.72,6.99 0 top
R23  6.35,13.34 90 bottom
R24  6.35,18.41 270 bottom
R25  32.38,57.15 270 top
R26  41.27,54.61 0 top
R27  38.1,36.2 270 bottom
R28  44.45,40.01 90 top
R29  48.26,50.16 270 bottom
R30  48.26,44.45 180 top
R31  48.26,40.64 270 bottom
R32  48.26,34.92 180 top
R33  35.56,36.2 90 bottom
R34  40.64,36.2 90 bottom
R35  31.75,53.98 0 top
R36  50.16,53.66 180 top
R37  25.4,57.78 180 top
S1  3.17,46.99 270 top
SJ1  34.29,15.24 0 top
SJ2  34.29,17.14 180 top
SJ3  40.01,23.5 0 top
SJ4  40.01,25.4 180 top
TP1  18.41,15.88 0 top
TP2  32.7,10.16 0 top
TP3  31.75,31.11 0 top
U1  24.13,24.77 0 top
U2  36.83,57.78 270 top
U3  37.47,37.47 180 top
U4  41.27,45.72 0 top
Y1  24.77,40.01 180 top

### Tracks (layer width: path | path; a pad name or v marks a point on that pad's centre or on a via)
5VSENSE  (via drill 0.6)
  Top 0.254: U1.9 16.39,25.52 14.92,26.99 12.38,26.99 v12.06,26.67 | R19.2 46.57,3.17 | 46.57,3.17 R18.1 | v46.35,3.17 46.57,3.17
  Top 0.305: v27.94,1.91 12.7,1.91 10.79,3.81 10.79,9.53 6.67,13.65 6.67,25.4 v8.26,26.99
  Bottom 0.254: v27.94,1.91 28.57,1.27 45.09,1.27 46.35,2.54 v46.35,3.17
  Bottom 0.305: v8.26,26.99 11.75,26.99 v12.06,26.67
12VSENSE  (via drill 0.6)
  Top 0.254: U1.10 16.26,25.02 15.24,26.04 v13.34,26.04 | R21.1 46.57,8.26 | 46.57,8.26 R22.2 | v45.72,8.26 46.57,8.26
  Top 0.305: v27.94,3.17 27.3,2.54 13.34,2.54 12.06,3.81 12.06,9.53 7.62,13.97 7.62,20.32 8.89,21.59 8.89,24.77 v8.26,25.4
  Bottom 0.254: v45.72,8.26 42.55,8.26 41.27,6.99 41.27,3.81 39.37,1.91 29.21,1.91 v27.94,3.17
  Bottom 0.305: v8.26,25.4 12.7,25.4 v13.34,26.04
+3V3  (via drill 0.6)
  Top 0.254: v35.56,3.17 36.83,1.91 39.47,1.91 R16.2 | JP5.2 13.97,39.37 15.88,37.47 v17.78,37.47 | LED4.A 8.89,53.98 11.43,56.52 13.97,56.52 15.24,55.24 JP15.2 | C11.1 44.4,34.77 U3.14 v41.91,36.2 41.91,36.83 44.23,39.16 R28.1 | v31.75,35.56 31.75,33.02 29.84,31.11 29.84,30.48
  Top 0.305: C1.1 13.12,20.85 C2.1 15.4,21.02 U1.18 18.48,21.02 19.05,21.59 | C1.1 R4.2 | C3.1 33.83,24.52 U1.50 30.09,24.52 29.84,24.77 | v34.92,20.32 JP2.1 | v33.02,19.05 29.84,19.05 | v12.06,17.78 11.43,18.41 11.43,20.32 12.06,20.95 12.38,20.95 C1.1 | v17.78,37.47 17.88,37.15 R6.2 | v31.75,35.56 32.38,36.2 32.38,40.01 34.29,41.91 34.29,45.09 36.83,47.62 U4.14 36.83,48.9 36.62,49.11 C12.1 36.62,51.85 | 36.62,51.85 36.83,52.07 38.73,52.07 40.01,53.34 40.01,54.19 R26.1 | R35.1 30.9,52.28 31.11,52.07 36.4,52.07 36.62,51.85 | C11.1 45.94,34.71 46.67,33.97 53.66,33.97 55.88,36.2 55.88,52.7 55.24,53.34 LED12.A
  Top 0.61: J11.13 J11.14 31.11,8.89 31.11,10.79 29.21,12.7 v29.21,13.97
  Bottom 0.254: J11.13 29.21,3.81 30.48,2.54 34.92,2.54 v35.56,3.17 | JP5.2 13.97,45.09 13.34,45.72 13.34,49.53 15.24,51.44 JP15.2 | v41.91,36.2 40.64,36.2 | 40.64,36.2 38.1,36.2 | 38.1,36.2 35.56,36.2 | 35.56,36.2 32.38,36.2 v31.75,35.56 | R27.2 38.1,36.2 | R33.2 35.56,36.2 | R34.1 40.64,36.2
  Bottom 0.305: v34.92,20.32 34.29,20.32 v33.02,19.05 | R23.2 R24.2 11.85,17.57 v12.06,17.78 | v19.05,29.84 19.05,36.2 v17.78,37.47
  Bottom 0.61: v29.21,13.97 28.57,14.61 28.57,20.32 v29.21,20.95
  pour Top: 18.41,30.48 18.41,19.05 29.84,19.05 29.84,30.48
+5V
  Top 0.254: R17.2 40.81,4.23 Q3.2 | R17.2 38.95,4.23 | 34.29,5.71 37.47,5.71 38.73,4.45 39.16,4.45 R17.2
  Top 0.61: JP7.4 5.71,26.33 5.71,11.43 9.84,7.3 9.84,3.49 12.38,0.95 33.66,0.95 34.29,1.59 J11.17 34.29,5.71 J11.18 34.29,7.16 34.47,7.16 36.83,9.53 36.83,10.79 37.47,11.43 JP8.2
+12V
  Top 0.254: 38.73,10.16 38.1,9.53 38.1,8.26 38.73,7.62 39.16,7.62 R20.2 40.81,7.41 Q4.2
  Top 0.305: 38.73,10.16 39.37,10.79 39.37,13.34
  Top 0.61: 31.75,3.81 J11.15 J11.16 34.92,10.16 34.92,12.7 35.56,13.34 39.37,13.34 45.09,13.34 46.35,12.06 JP13.1
AVCC
  Top 0.305: R4.1 C5.1 15.07,24.52 U1.11
CAN_/CS
  Top 0.305: U1.32 24.88,11.54 23.5,10.16 20.95,10.16 19.05,8.26 17.78,8.26 J11.4
CAN_/INT
  Top 0.254: 20.32,8.26 20.32,5.71 J11.5
  Top 0.305: U1.33 25.38,10.78 24.13,9.53 21.59,9.53 20.32,8.26
CAN_/RX0BF
  Top 0.305: U1.34 25.88,10.01 24.77,8.89 23.5,8.89 J11.8
CAN_/RX1BF
  Top 0.254: 25.4,8.26 25.4,6.35 24.77,5.71 22.86,5.71 J11.7
  Top 0.305: U1.35 26.38,9.23 25.4,8.26
CAN_MISO  (via drill 0.6)
  Top 0.305: U1.38 27.88,10.86 29.21,9.53 v29.84,9.53
  Bottom 0.305: J11.6 21.59,9.53 27.3,9.53 27.94,10.16 28.57,10.16 29.21,9.53 v29.84,9.53
CAN_MOSI  (via drill 0.6)
  Top 0.305: U1.37 27.38,10.09 v28.57,8.89
  Bottom 0.254: J11.3 17.78,5.71 22.23,5.71 22.86,6.35 22.86,7.62
  Bottom 0.305: 22.86,7.62 22.86,8.26 23.5,8.89 v28.57,8.89
CAN_SCK  (via drill 0.6)
  Top 0.305: U1.39 28.38,11.62 v29.21,10.79
  Bottom 0.305: J11.1 12.06,6.35 12.06,8.26 12.7,8.89 19.05,8.89 20.32,10.16 26.67,10.16 27.3,10.79 v29.21,10.79
CAN_STBY
  Top 0.254: 27.94,8.26 27.94,5.71 J11.11
  Top 0.305: U1.36 26.88,9.31 27.94,8.26
DBG_LED1
  Top 0.305: R1.2 18.63,15.66 TP1.1 19.38,16.84 U1.21
DBG_LED2  (via drill 0.6)
  Top 0.305: U1.31 24.38,12.31 v23.5,11.43 | R2.2 33.66,10.79 TP2.1
  Bottom 0.305: v23.5,11.43 27.94,11.43 28.57,12.06 29.84,12.06 31.75,10.16 TP2.1
DBG_LED3
  Top 0.254: U1.60 31.42,29.52 31.75,29.84 TP3.1 32.38,31.75 R3.2
DBG_RXD
  Top 0.305: U1.41 33.96,20.02 36.2,17.78 36.2,17.35 SJ2.1 SJ1.3 36.2,15.03 R7.2
DBG_TXD
  Top 0.305: SJ2.3 SJ1.1 32.38,15.03 R9.2 28.88,16.62 U1.40
DRILL_EN  (via drill 0.6)
  Top 0.254: U1.59 31.87,29.02 33.34,30.48 35.56,30.48 36.2,31.11 36.2,31.75 38.1,33.66 U3.11 38.1,36.83 39.37,38.1 U3.3
  Top 0.305: 39.37,41.27 38.73,41.27 38.1,41.91 U4.2 v38.1,44.45 | 39.37,41.27 U3.3 | U4.4 40.64,41.91 40.01,41.27 39.37,41.27 | U4.10 41.91,49.53 41.27,50.16 40.01,50.16 39.37,49.53 U4.12 v39.37,46.99
  Bottom 0.305: v39.37,46.99 38.1,45.72 v38.1,44.45
DRILL_ISENSE_/FAULT  (via drill 0.6)
  Top 0.254: U1.24 20.88,13.26 19.05,11.43 14.61,11.43 9.53,16.51 9.53,27.3 8.26,28.57 v7.62,28.57 | v7.62,33.02 7.62,53.98 10.79,57.15 21.59,57.15 22.86,55.88 JP15.5
  Bottom 0.254: v7.62,28.57 v7.62,33.02
DRILL_ISENSE_FAULT_EN
  Top 0.254: U1.77 20.88,32.78 18.41,34.92 17.14,34.92 14.29,37.78 10.48,37.78 9.53,38.73 9.53,45.72 14.61,50.8 24.13,50.8 25.4,52.07 JP15.6
DRILL_ISENSE_VIOUT
  Top 0.254: U1.79 19.88,32.51 18.41,33.66 17.14,33.66 14.29,36.51 10.48,36.51 8.26,38.73 8.26,46.99 13.97,52.7 16.51,52.7 17.78,53.98 JP15.3
DRILL_ISENSE_VZCR
  Top 0.254: U1.78 20.38,32.64 18.41,34.29 17.14,34.29 14.29,37.15 10.48,37.15 8.89,38.73 8.89,46.35 14.61,52.07 19.68,52.07 20.32,52.7 JP15.4
DRILL_RELAY_1
  Top 0.305: Q6.6 47.61,49.55 47.62,49.53 52.41,49.53 JP14.4
DRILL_RELAY_2
  Top 0.305: Q6.3 48.91,48.24 52.07,45.09 53.33,45.09 JP14.3
DRILL_RELAY_3
  Top 0.305: Q7.6 47.61,40.02 47.62,40.01 51.74,40.01 JP14.2
DRILL_RELAY_4
  Top 0.305: Q7.3 48.91,38.72 49.53,38.1 JP14.1
DRILL_S1
  Top 0.254: U3.2 40.64,38.1 38.73,36.2 38.73,33.66 36.83,31.75 36.83,30.48 36.2,29.84 33.34,29.84 32.01,28.52 U1.58
DRILL_S2
  Top 0.254: U1.57 32.14,28.02 33.34,29.21 36.83,29.21 37.47,29.84 37.47,31.75 39.37,33.66 U3.12
ESTOP+
  Top 0.406: R25.2 41.7,56.3 42.55,57.15 JP9.1
ESTOP-
  Bottom 0.406: JP9.2 36.2,59.69 35.56,60.33 U2.2
ESTOP_LOCAL  (via drill 0.6)
  Top 0.254: U1.25 21.38,13.12 19.05,10.79 14.61,10.79 v13.97,10.16 | v49.53,13.34 49.53,17.78 49.21,18.1 49.21,19.68 | R13.1 50.16,27.3 49.85,26.99 49.85,22.54 49.21,21.91 49.21,19.68 | Q1.2 Q1.5 49.21,19.68
  Top 0.305: JP12.1 42.12,52.46 R26.2 42.12,55.46 43.18,56.52 48.26,56.52 48.9,55.88 v48.9,55.24 48.9,55.26 Q5.6 Q5.5
  Top 0.406: R13.1 51.65,27.09 v51.75,26.99
  Bottom 0.254: v13.97,10.16 12.7,10.16 11.43,8.89 11.43,3.81 13.97,1.27 26.67,1.27 27.3,0.64 45.72,0.64 47.62,2.54 47.62,3.81 46.99,4.45 46.99,6.99 49.53,9.53 v49.53,13.34
  Bottom 0.305: 53.98,53.34 52.7,54.61 49.53,54.61 v48.9,55.24
  Bottom 0.406: v51.75,26.99 51.75,30.16 55.88,34.29 55.88,51.44 53.98,53.34
ESTOP_LOCAL_INV  (via drill 0.6)
  Top 0.305: v44.45,53.98 45.09,53.98 45.72,54.61 Q5.2 | U2.4 36.83,52.7 33.02,52.7 32.38,53.34 32.38,53.76 | 32.38,53.76 R35.2 | 32.38,53.76 32.38,54.61 29.21,57.78 R37.1
  Bottom 0.305: U2.4 38.73,53.98 39.37,54.61 43.81,54.61 v44.45,53.98
ESTOP_RELAY
  Top 0.254: Q1.4 50,20.79 51.44,22.23 52.07,22.23 52.7,21.59 52.7,19.05
  Top 0.305: Q1.1 52.72,19.04 52.7,19.05 52.7,16.2 JP13.2
GND  (via drill 0.6)
  Top 0.254: C7.2 25.82,37.25 26.04,37.47 29.84,37.47 30.48,38.1 30.48,40.64 28.57,42.55 20.32,42.55 19.05,41.27 19.05,38.73 20.32,37.47 22.23,37.47 v23.5,36.2 | Q1.6 50,18.58 v50.48,18.1 | Q1.3 51.6,21.12 v51.75,21.27 | R22.1 44.87,6.57 v45.72,5.71 44.87,4.87 R19.1 | Q2.1 48.56,0.94 v48.9,1.27 | v42.55,3.17 42.55,2.39 Q2.4 | C3.2 35.14,23.28 35.56,22.86 v35.56,22.54 35.98,22.96 35.98,23.91 | LED7.C LED6.C LED5.C v49.53,33.02 | v44.45,37.78 C11.2 | U3.7 34.29,38.73 | 34.29,38.73 34.29,36.83 33.02,35.56 LED3.C | v33.66,38.73 34.29,38.73
  Top 0.305: C1.2 13.02,19.37 13.34,19.05 13.34,18.1 v13.65,17.78 | v13.65,17.78 15.03,19.15 C2.2 15.46,19.37 15.88,19.37 15.88,19.68 16.19,20 16.19,20.32 16.39,20.52 U1.19 18.86,20.52 v19.05,20.32 | C4.2 14.92,17.14 14.61,17.46 13.97,17.46 v13.65,17.78 | C5.2 14.87,23.02 U1.14 18.89,23.02 v19.05,22.86 | C3.2 33.55,24.02 U1.49 29.32,24.02 v29.21,24.13 | v25.4,29.84 25.38,29.86 U1.68 25.38,33.85 C6.2 C7.2 | U1.61 28.88,32.05 29.21,32.38 v29.84,32.38 30.48,33.02 30.48,33.66 30.7,33.87 R5.1 | C8.2 22.76,34.19 v21.91,35.24 | LED1.C 13.86,16.39 v13.65,16.51 | R9.1 v30.48,18.1 | v38.1,18.1 R7.1 | R15.1 35.98,23.91 | v43.81,22.54 R14.1 | LED2.C 30.36,12.81 31.11,12.06 v31.75,12.06 | Q6.4 48.91,50.5 49.21,50.8 | 49.21,50.8 v50.16,50.8 | Q7.4 48.91,40.97 49.21,41.27 | 49.21,41.27 v50.16,41.27 | LED10.C 49.01,41.48 49.21,41.27 | Q7.1 47.61,38.72 v46.99,38.1 46.99,37.47 47.51,36.95 LED11.C | Q6.1 47.61,48.24 v46.99,47.62 46.99,46.99 47.51,46.47 LED9.C | LED8.C 49.01,51 49.21,50.8 | U4.7 v44.45,44.45 | v39.69,51.44 38.95,51.44 C12.2 | 45.1,55.26 v45.09,55.24 45.09,55.26 Q5.1 46.2,55.24 46.99,55.24 46.99,53.98 47.01,53.96 Q5.4 | R37.2 v23.18,57.78
  pour Bottom: 0,0 0,63.5 57.15,63.5 57.15,0
LOWER_SWITCH  (via drill 0.6)
  Top 0.305: U1.29 23.38,13.86 18.41,8.89 13.97,8.89 8.57,14.29 v8.57,19.05
  Bottom 0.305: JP11.2 6.25,19.36 R24.1 8.04,19.27 v8.57,19.05
N$1
  Top 0.305: JP2.2 46.35,20.32 JP4.P$4
N$2  (via drill 0.6)
  Top 0.254: v8.89,49.53 LED4.C
  Bottom 0.254: R8.2 7.62,52.7 8.89,51.44 v8.89,49.53
N$3
  Top 0.254: LED5.A 46.24,33.66 40.01,33.66 38.73,32.38 R10.1
N$4
  Top 0.254: R11.1 41.27,32.38 41.91,33.02 45.09,33.02 46.35,31.75 LED6.A
N$5
  Top 0.254: R12.1 44.87,31.96 46.35,30.48 LED7.A
N$6
  Top 0.305: LED1.A R1.1
N$7
  Top 0.305: U1.63 27.88,32.64 28.57,33.34 28.57,33.55 R5.2
N$8
  Top 0.305: LED2.A 33.44,13.34 R2.1
N$9  (via drill 0.6)
  Top 0.254: Q3.3 43.01,5.25 42.86,5.4 v42.86,6.35 | v45.09,3.17 45.72,2.54 45.72,2.12 R18.2
  Bottom 0.254: v42.86,6.35 42.86,5.4 v45.09,3.17
N$10
  Top 0.254: R17.1 40.81,5.93 | 40.81,5.93 Q3.1 | 40.81,5.93 41.7,5.93 41.91,5.71 41.91,3.81 40.64,2.54 40.64,0.95 40.96,0.64 42.4,0.64 Q2.6
N$11
  Top 0.254: Q4.3 43.81,8.26 44.45,8.89 44.45,9.11 R21.2
N$12
  Top 0.254: Q2.2 Q2.5 R16.1
N$13
  Top 0.406: R25.1 36.41,58 38.1,59.69 U2.1
N$14
  Top 0.305: LED9.A 49.01,44.55 R30.1
N$15
  Top 0.305: Q5.3 46.19,53.51 46.35,53.34 49.53,53.34 49.31,53.55 R36.2
N$16
  Top 0.305: LED12.C 51.33,53.34 R36.1
N$20
  Top 0.305: U4.1 U3.5
N$22
  Top 0.305: U3.6 35.56,43.81 37.47,45.72 41.27,45.72 41.91,45.09 U4.5
N$23  (via drill 0.6)
  Top 0.254: U3.9 35.56,38.1 v36.2,38.73
  Top 0.305: U4.9 v43.18,46.99
  Bottom 0.305: v43.18,46.99 41.91,48.26 38.1,48.26 36.2,46.35 v36.2,38.73
N$25
  Top 0.254: U3.8 34.29,35.56 34.92,36.2 34.92,41.27
  Top 0.305: 34.92,41.27 34.92,44.45 38.1,47.62 U4.13
N$26  (via drill 0.6)
  Top 0.254: U3.4 v38.1,38.73
  Bottom 0.254: R27.1 v38.1,38.73
N$27
  Top 0.254: R28.2 42.12,40.85 41.91,40.64 U3.1
N$28  (via drill 0.6)
  Top 0.254: U3.10 36.83,33.66 v36.2,33.02
  Bottom 0.254: R33.1 35.56,33.66 v36.2,33.02
N$29  (via drill 0.6)
  Top 0.254: U3.13 40.64,36.83 v41.91,38.1
  Bottom 0.254: R34.2 40.85,37.05 v41.91,38.1
N$33
  Top 0.305: LED11.A 49.01,35.02 R32.1
N$36
  Top 0.254: LED3.A 33.13,33.54 33.66,33.02 34.29,33.02 34.92,32.38 34.92,31.96 R3.1
NU_P6.3
  Top 0.254: U1.80 19.38,32.05 19.05,32.38 17.14,32.38 14.61,34.92 JP1.5
NU_P6.4
  Top 0.254: U1.1 16.84,29.52 16.51,29.84 16.51,31.75 14.61,33.66 12.7,33.66 JP1.6
NU_P6.5
  Top 0.254: U1.2 16.07,29.02 15.88,29.21 15.88,30.48 JP1.3
NU_P6.6
  Top 0.254: U1.3 15.94,28.52 15.24,29.21 15.24,30.48 14.61,31.11 12.7,31.11 JP1.4
NU_P6.7
  Top 0.254: U1.4 15.8,28.02 JP1.1
RC_PWR
  Top 0.61: JP6.2 54.61,23.5 53.34,22.23 53.34,19.68 55.24,17.78 55.24,10.79 54.61,10.16 49.53,10.16 48.9,10.79 45.72,10.79 45.09,11.43 JP8.1
RC_RXD
  Top 0.254: U1.52 32.18,25.52 33.34,26.67 34.29,26.67
  Top 0.305: SJ4.1 SJ3.3 | R14.2 41.92,25.61 SJ4.1 | 34.29,26.67 38.73,26.67 39.69,27.62 40.96,27.62 41.91,26.67 41.91,25.61 SJ4.1
RC_S1  (via drill 0.6)
  Top 0.254: 46.35,22.86 v48.9,22.86 | v50.8,22.86 51.94,22.86 JP6.3
  Top 0.305: SJ3.2 40.01,22.86 40.64,22.23 42.55,22.23 43.18,21.59 44.45,21.59 45.72,22.86 46.35,22.86
  Bottom 0.254: v48.9,22.86 v50.8,22.86
RC_S2  (via drill 0.6)
  Top 0.254: 48.9,27.94 54.74,27.94 JP6.4
  Top 0.305: v40.01,26.67 SJ4.2 | v42.55,27.3 45.72,27.3 46.99,28.57 48.26,28.57 48.9,27.94
  Bottom 0.305: v40.01,26.67 41.91,26.67 v42.55,27.3
RC_S3
  Top 0.305: JP6.5 51.44,31.11 50.16,29.84 R13.2
RC_TXD
  Top 0.254: U1.51 32.32,25.02 33.34,26.04 35.77,26.04 R15.2
  Top 0.305: R15.2 38.09,25.61 SJ4.3 SJ3.1
RELAY1_CNTRL  (via drill 0.6)
  Top 0.305: Q6.2 v48.26,47.62 | U4.3 39.37,43.81 40.01,44.45 v40.64,44.45
  Bottom 0.305: v40.64,44.45 43.18,44.45 44.45,45.72 47.62,45.72 48.26,46.35 v48.26,47.62 R29.2
RELAY1_LED_A  (via drill 0.6)
  Top 0.305: v46.35,52.07 LED8.A
  Bottom 0.305: R29.1 48.26,51.32 LED8.A v46.35,52.07
RELAY2_CNTRL
  Top 0.305: R30.2 47.41,44.66 46.04,46.04 | 46.04,46.04 46.04,50.16 46.99,51.12 47.94,51.12 48.26,50.8 Q6.5 | U4.6 43.18,45.09 43.81,45.72 45.72,45.72 46.04,46.04
RELAY3_CNTRL  (via drill 0.6)
  Top 0.305: Q7.2 v48.26,38.1 | v44.45,46.99 U4.8
  Bottom 0.305: v48.26,38.1 R31.2 46.57,39.79 43.18,43.18 40.01,43.18 39.37,43.81 39.37,45.09 40.01,45.72 43.18,45.72 v44.45,46.99
RELAY3_LED_A  (via drill 0.6)
  Top 0.305: LED10.A v46.35,42.55
  Bottom 0.305: R31.1 48.26,41.8 LED10.A v46.35,42.55
RELAY4_CNTRL
  Top 0.305: Q7.5 48.26,41.27 47.94,41.59 46.04,41.59 | 46.04,41.59 46.04,36.3 R32.2 | 46.04,41.59 45.72,41.91 43.81,41.91 43.5,41.59 42.86,41.59 42.55,41.91 42.55,45.72 40.64,47.62 U4.11
RXI  (via drill 0.6)
  Top 0.305: SJ2.2 v34.29,18.41 | v36.83,19.05 38.73,19.05 39.37,18.41 46.99,18.41 JP4.P$3
  Bottom 0.305: v36.83,19.05 34.92,19.05 v34.29,18.41
SBWTCK
  Top 0.254: U1.71 23.88,34.54 21.59,36.83 20.32,36.83 18.41,38.73 18.41,41.27 22.86,45.72 JP3.7
SBWTDIO  (via drill 0.6)
  Top 0.254: 19.68,35.98 19.68,36.83 17.78,38.73 17.78,43.81 JP3.1 13.97,46.35 v11.43,43.81 | 19.68,35.98 R6.1 | 19.68,35.98 20.54,35.98 20.95,35.56 20.95,34.08 C8.1
  Top 0.305: U1.76 21.38,33.33 C8.1
  Bottom 0.254: S1.2 3.52,45.09 10.16,45.09 v11.43,43.81
STAT_ERR
  Top 0.254: U1.54 32.55,26.52 33.34,27.3 38.73,27.3 40.01,28.57 43.18,28.57 43.81,29.21 R12.2
STAT_OK
  Top 0.254: U1.56 32.28,27.52 33.34,28.57 38.1,28.57 38.73,29.21 R10.2
STAT_WARN
  Top 0.254: U1.55 32.41,27.02 33.34,27.94 38.73,27.94 40.01,29.21 40.64,29.21 41.27,29.84 R11.2 41.27,30.48
STEPPER_DIR
  Top 0.254: U1.6 16.16,27.02 14.61,28.57 10.47,28.57 JP7.2
STEPPER_EN
  Top 0.254: U1.7 16.03,26.52 14.61,27.94 10.16,27.94 6.35,31.75 3.83,31.75 JP7.3
STEPPER_STEP
  Top 0.254: U1.23 20.38,13.39 19.05,12.06 14.61,12.06 10.16,16.51 10.16,27.3 7.3,30.16 2.54,30.16 2.22,30.48 2.22,37.15 JP7.1
TXO
  Top 0.305: SJ1.2 34.29,14.61 34.92,13.97 45.09,13.97 JP4.P$2
UPPER_SWITCH  (via drill 0.6)
  Top 0.305: U1.30 23.88,13.09 v22.23,11.43
  Bottom 0.305: v22.23,11.43 6.35,11.43 | 6.35,11.43 4.75,11.43 JP10.2 | R23.1 6.35,11.43
V18
  Top 0.254: U1.67 25.88,32.55 26.67,33.34 26.67,35.34 C7.1
VCC_TARGET
  Bottom 0.254: JP5.1 16.51,47.62 JP3.4
VCC_TOOL
  Top 0.254: JP3.2 10.16,43.81 10.16,40.64 11.43,39.37 JP5.3
VCORE
  Top 0.305: U1.20 16.84,20.02 16.83,20 16.83,17.25 C4.1
VTAP_EN
  Top 0.254: R20.1 40.81,9.11 | 40.81,9.11 Q4.1 | 40.81,9.11 41.06,9.11 41.91,8.26 41.91,7.62 42.23,7.3 43.18,7.3 43.81,6.67 43.81,2.72 Q2.3
VUSB
  Top 0.254: U1.66 26.38,32.41 27.3,33.34 27.3,33.76
  Top 0.305: 27.3,33.76 C6.1
XT2IN
  Top 0.305: U1.69 24.88,38.85 26.04,40.01 Y1.1
  Bottom 0.305: C9.1 28.03,40.85 Y1.1
XT2OUT
  Top 0.305: U1.70 24.38,39.12 23.5,40.01 Y1.2
  Bottom 0.305: C10.1 21.5,40.85 Y1.2

### Text on the board
tNames: ESTOP | MCU RESET | RLY1 | RLY2 | RLY3 | P6.4 | P6.3 | RLY4 | ESTOP | P6.6 | P6.5 | Status | Good | GND | P6.7 | WARN | ERR | S2 | S1 | PWR | GND | CLEANUP / Team NSH / Mobility-Elim / Controller | DBG1 | Debug UART | DBG2